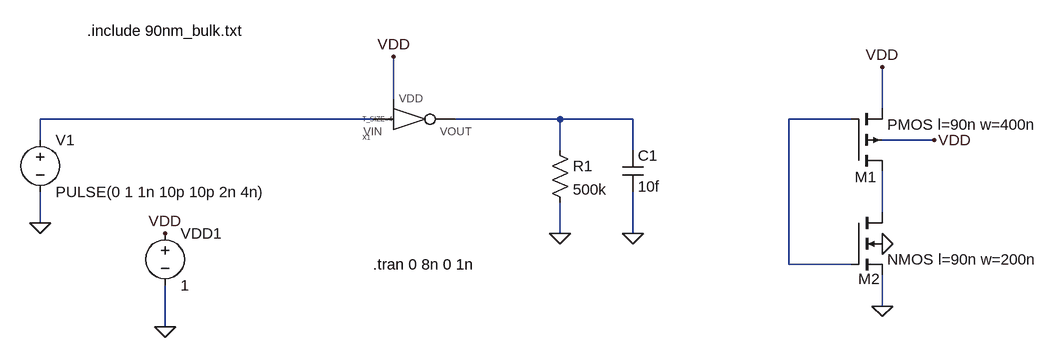
[diagram p0: schematic Draft1.asc]
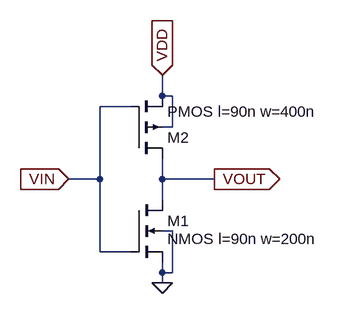
[diagram p1: sub-circuit inverter.asc]
Draft1.asc, the LTspice schematic file:
Version 4
SHEET 1 1172 680
WIRE 160 80 160 16
WIRE 912 96 912 32
WIRE 128 112 -384 112
WIRE 416 112 256 112
WIRE 528 112 416 112
WIRE 864 112 768 112
WIRE -384 144 -384 112
WIRE 992 144 912 144
WIRE 416 160 416 112
WIRE 528 160 528 112
WIRE 912 256 912 192
WIRE -384 272 -384 224
WIRE 416 288 416 240
WIRE 528 288 528 224
WIRE 768 336 768 112
WIRE 864 336 768 336
WIRE 912 400 912 352
WIRE -192 432 -192 368
FLAG 416 288 0
FLAG 528 288 0
FLAG 912 400 0
FLAG -384 272 0
FLAG -192 432 0
FLAG -192 288 VDD
FLAG 912 32 VDD
FLAG 992 144 VDD
FLAG 912 304 0
FLAG 160 16 VDD
SYMBOL nmos4 864 256 R0
WINDOW 0 11 102 Left 2
SYMATTR InstName M2
SYMATTR Value NMOS l=90n w=200n
SYMBOL pmos4 864 192 M180
WINDOW 0 6 -9 Left 2
SYMATTR InstName M1
SYMATTR Value PMOS l=90n w=400n
SYMBOL cap 512 160 R0
SYMATTR InstName C1
SYMATTR Value 10f
SYMBOL voltage -384 128 R0
SYMATTR InstName V1
SYMATTR Value PULSE(0 1 1n 10p 10p 2n 4n)
SYMBOL voltage -192 272 R0
SYMATTR InstName VDD1
SYMATTR Value 1
SYMBOL res 400 144 R0
SYMATTR InstName R1
SYMATTR Value 500k
SYMBOL inverter 112 112 R0
WINDOW 0 0 28 Left 0
WINDOW 39 0 0 Left 0
SYMATTR InstName X1
SYMATTR SpiceLine T_SIZE=4
TEXT -312 -24 Left 2 !.include 90nm_bulk.txt
TEXT 128 336 Left 2 !.tran 0 8n 0 1n

inverter.asc, the sub-circuit schematic file:
Version 4
SHEET 1 880 680
WIRE 240 16 240 -16
WIRE 256 16 240 16
WIRE 192 32 144 32
WIRE 256 64 256 16
WIRE 256 64 240 64
WIRE 144 144 144 32
WIRE 144 144 96 144
WIRE 240 144 240 112
WIRE 320 144 240 144
WIRE 240 176 240 144
WIRE 256 224 240 224
WIRE 144 256 144 144
WIRE 192 256 144 256
WIRE 240 288 240 272
WIRE 256 288 256 224
WIRE 256 288 240 288
WIRE 240 304 240 288
FLAG 320 144 VOUT
IOPIN 320 144 Out
FLAG 240 304 0
FLAG 240 -16 VDD
IOPIN 240 -16 In
FLAG 96 144 VIN
IOPIN 96 144 In
SYMBOL pmos4 192 112 M180
SYMATTR InstName M2
SYMATTR Value PMOS l=90n w=400n
SYMBOL nmos4 192 176 R0
WINDOW 3 56 60 Left 2
SYMATTR InstName M1
SYMATTR Value NMOS l=90n w=200n

The netlist it stands for:
* Draft1.asc
M2 N004 N003 0 0 NMOS l=90n w=200n
M1 N004 N003 VDD VDD PMOS l=90n w=400n
C1 N002 0 10f
V1 N001 0 PULSE(0 1 1n 10p 10p 2n 4n)
VDD1 VDD 0 1
R1 N002 0 500k
XX1 N001 VDD N002 inverter params: T_SIZE=4

* block symbol definitions
.subckt inverter VIN VDD VOUT
M2 VOUT VIN VDD VDD PMOS l=90n w=400n
M1 VOUT VIN 0 0 NMOS l=90n w=200n
.ends inverter

.model NMOS NMOS
.model PMOS PMOS
.lib standard.mos
.include 90nm_bulk.txt
.tran 0 8n 0 1n
.backanno
.end